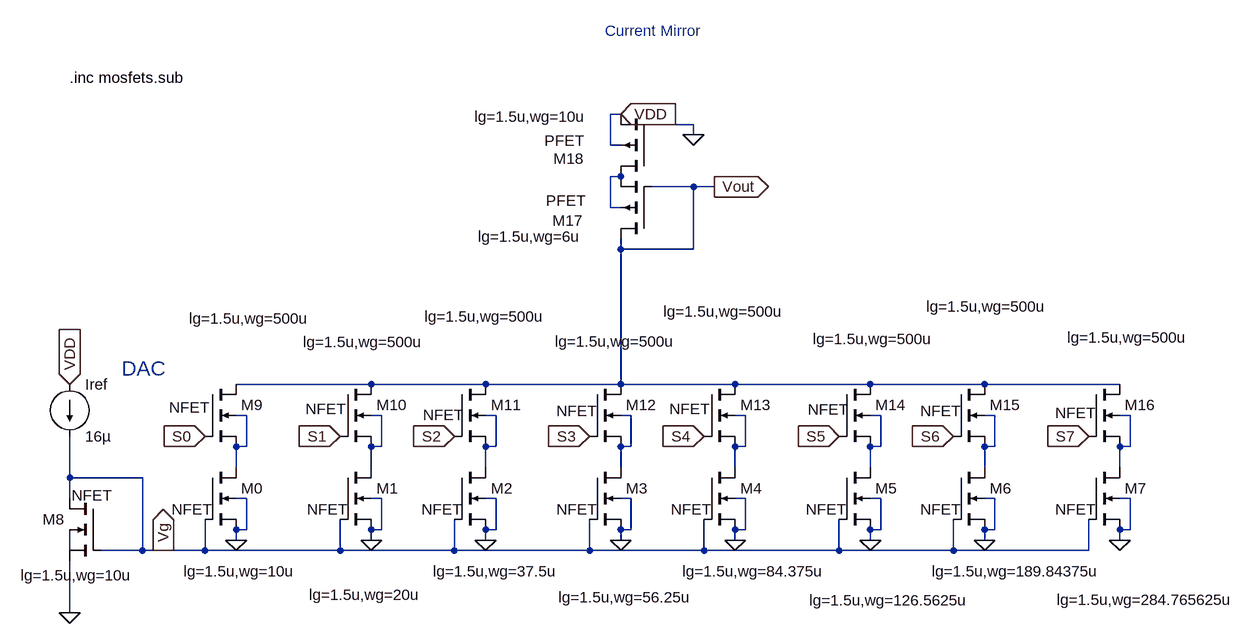
[diagram p0: schematic 3_DAC_winterg.asc]
3_DAC_winterg.asc, the LTspice schematic file:
Version 4
SHEET 1 1748 680
WIRE 784 -240 768 -240
WIRE 896 -224 832 -224
WIRE 896 -208 896 -224
WIRE 768 -192 768 -240
WIRE 784 -192 768 -192
WIRE 784 -144 768 -144
WIRE 896 -128 832 -128
WIRE 928 -128 896 -128
WIRE 768 -96 768 -144
WIRE 784 -96 768 -96
WIRE 784 -32 784 -48
WIRE 896 -32 896 -128
WIRE 896 -32 784 -32
WIRE 400 176 192 176
WIRE 576 176 400 176
WIRE 784 176 784 -32
WIRE 784 176 576 176
WIRE 960 176 784 176
WIRE 1168 176 960 176
WIRE 1344 176 1168 176
WIRE 1552 176 1344 176
WIRE 208 224 192 224
WIRE 416 224 400 224
WIRE 592 224 576 224
WIRE 800 224 784 224
WIRE 976 224 960 224
WIRE 1184 224 1168 224
WIRE 1360 224 1344 224
WIRE 1568 224 1552 224
WIRE 208 272 208 224
WIRE 208 272 192 272
WIRE 416 272 416 224
WIRE 416 272 400 272
WIRE 592 272 592 224
WIRE 592 272 576 272
WIRE 800 272 800 224
WIRE 800 272 784 272
WIRE 976 272 976 224
WIRE 976 272 960 272
WIRE 1184 272 1184 224
WIRE 1184 272 1168 272
WIRE 1360 272 1360 224
WIRE 1360 272 1344 272
WIRE 1568 272 1568 224
WIRE 1568 272 1552 272
WIRE 192 304 192 272
WIRE 400 304 400 272
WIRE 576 304 576 272
WIRE 784 304 784 272
WIRE 960 304 960 272
WIRE 1168 304 1168 272
WIRE 1344 304 1344 272
WIRE 1552 304 1552 272
WIRE -64 320 -64 256
WIRE 48 320 -64 320
WIRE -64 352 -64 320
WIRE 208 352 192 352
WIRE 416 352 400 352
WIRE 592 352 576 352
WIRE 800 352 784 352
WIRE 976 352 960 352
WIRE 1184 352 1168 352
WIRE 1360 352 1344 352
WIRE 1568 352 1552 352
WIRE 208 400 208 352
WIRE 208 400 192 400
WIRE 416 400 416 352
WIRE 416 400 400 400
WIRE 592 400 592 352
WIRE 592 400 576 400
WIRE 800 400 800 352
WIRE 800 400 784 400
WIRE 976 400 976 352
WIRE 976 400 960 400
WIRE 1184 400 1184 352
WIRE 1184 400 1168 400
WIRE 1360 400 1360 352
WIRE 1360 400 1344 400
WIRE 1568 400 1568 352
WIRE 1568 400 1552 400
WIRE 192 416 192 400
WIRE 208 416 192 416
WIRE 400 416 400 400
WIRE 576 416 576 400
WIRE 784 416 784 400
WIRE 960 416 960 400
WIRE 1168 416 1168 400
WIRE 1344 416 1344 400
WIRE 1552 416 1552 400
WIRE -64 432 -64 400
WIRE 48 432 48 320
WIRE 48 432 -16 432
WIRE 80 432 48 432
WIRE 144 432 144 384
WIRE 144 432 80 432
WIRE 352 432 352 384
WIRE 352 432 144 432
WIRE 528 432 528 384
WIRE 528 432 352 432
WIRE 736 432 736 384
WIRE 736 432 528 432
WIRE 912 432 912 384
WIRE 912 432 736 432
WIRE 1120 432 1120 384
WIRE 1120 432 912 432
WIRE 1296 432 1296 384
WIRE 1296 432 1120 432
WIRE 1504 432 1504 384
WIRE 1504 432 1296 432
WIRE -64 528 -64 448
FLAG -64 176 VDD
IOPIN -64 176 In
FLAG -64 528 0
FLAG 192 416 0
FLAG 400 416 0
FLAG 576 416 0
FLAG 784 416 0
FLAG 960 416 0
FLAG 1168 416 0
FLAG 1344 416 0
FLAG 1552 416 0
FLAG 144 256 S0
IOPIN 144 256 In
FLAG 352 256 S1
IOPIN 352 256 In
FLAG 528 256 S2
IOPIN 528 256 In
FLAG 736 256 S3
IOPIN 736 256 In
FLAG 912 256 S4
IOPIN 912 256 In
FLAG 1120 256 S5
IOPIN 1120 256 In
FLAG 1296 256 S6
IOPIN 1296 256 In
FLAG 1504 256 S7
IOPIN 1504 256 In
FLAG 928 -128 Vout
IOPIN 928 -128 Out
FLAG 784 -240 VDD
IOPIN 784 -240 In
FLAG 896 -208 0
FLAG 80 432 Vg
IOPIN 80 432 Out
SYMBOL current -64 176 R0
SYMATTR InstName Iref
SYMATTR Value 16µ
SYMBOL nmos4 -16 352 M0
WINDOW 123 -49 118 Left 2
WINDOW 3 -18 -5 Left 2
SYMATTR Value2 lg=1.5u,wg=10u
SYMATTR Value NFET
SYMATTR InstName M8
SYMATTR Prefix X
SYMBOL nmos4 144 304 R0
WINDOW 123 -33 160 Left 2
WINDOW 3 -51 65 Left 2
SYMATTR Value2 lg=1.5u,wg=10u
SYMATTR Value NFET
SYMATTR InstName M0
SYMATTR Prefix X
SYMBOL nmos4 352 304 R0
WINDOW 123 -48 196 Left 2
WINDOW 3 -51 65 Left 2
SYMATTR Value2 lg=1.5u,wg=20u
SYMATTR Value NFET
SYMATTR InstName M1
SYMATTR Prefix X
SYMBOL nmos4 528 304 R0
WINDOW 123 -33 160 Left 2
WINDOW 3 -51 65 Left 2
SYMATTR Value2 lg=1.5u,wg=37.5u
SYMATTR Value NFET
SYMATTR InstName M2
SYMATTR Prefix X
SYMBOL nmos4 736 304 R0
WINDOW 123 -48 200 Left 2
WINDOW 3 -51 65 Left 2
SYMATTR Value2 lg=1.5u,wg=56.25u
SYMATTR Value NFET
SYMATTR InstName M3
SYMATTR Prefix X
SYMBOL nmos4 912 304 R0
WINDOW 123 -33 160 Left 2
WINDOW 3 -51 65 Left 2
SYMATTR Value2 lg=1.5u,wg=84.375u
SYMATTR Value NFET
SYMATTR InstName M4
SYMATTR Prefix X
SYMBOL nmos4 1120 304 R0
WINDOW 123 -46 205 Left 2
WINDOW 3 -51 65 Left 2
SYMATTR Value2 lg=1.5u,wg=126.5625u
SYMATTR Value NFET
SYMATTR InstName M5
SYMATTR Prefix X
SYMBOL nmos4 1296 304 R0
WINDOW 123 -33 160 Left 2
WINDOW 3 -51 65 Left 2
SYMATTR Value2 lg=1.5u,wg=189.84375u
SYMATTR Value NFET
SYMATTR InstName M6
SYMATTR Prefix X
SYMBOL nmos4 1504 304 R0
WINDOW 123 -49 204 Left 2
WINDOW 3 -51 65 Left 2
SYMATTR Value2 lg=1.5u,wg=284.765625u
SYMATTR Value NFET
SYMATTR InstName M7
SYMATTR Prefix X
SYMBOL nmos4 144 176 R0
WINDOW 123 -24 -101 Left 2
WINDOW 3 -55 36 Left 2
SYMATTR Value2 lg=1.5u,wg=500u
SYMATTR Value NFET
SYMATTR InstName M9
SYMATTR Prefix X
SYMBOL nmos4 352 176 R0
WINDOW 123 -57 -65 Left 2
WINDOW 3 -53 38 Left 2
SYMATTR Value2 lg=1.5u,wg=500u
SYMATTR Value NFET
SYMATTR InstName M10
SYMATTR Prefix X
SYMBOL nmos4 528 176 R0
WINDOW 123 -46 -104 Left 2
WINDOW 3 -48 47 Left 2
SYMATTR Value2 lg=1.5u,wg=500u
SYMATTR Value NFET
SYMATTR InstName M11
SYMATTR Prefix X
SYMBOL nmos4 736 176 R0
WINDOW 123 -53 -66 Left 2
WINDOW 3 -51 41 Left 2
SYMATTR Value2 lg=1.5u,wg=500u
SYMATTR Value NFET
SYMATTR InstName M12
SYMATTR Prefix X
SYMBOL nmos4 912 176 R0
WINDOW 123 -62 -112 Left 2
WINDOW 3 -53 38 Left 2
SYMATTR Value2 lg=1.5u,wg=500u
SYMATTR Value NFET
SYMATTR InstName M13
SYMATTR Prefix X
SYMBOL nmos4 1120 176 R0
WINDOW 123 -40 -70 Left 2
WINDOW 3 -48 39 Left 2
SYMATTR Value2 lg=1.5u,wg=500u
SYMATTR Value NFET
SYMATTR InstName M14
SYMATTR Prefix X
SYMBOL nmos4 1296 176 R0
WINDOW 123 -42 -120 Left 2
WINDOW 3 -51 41 Left 2
SYMATTR Value2 lg=1.5u,wg=500u
SYMATTR Value NFET
SYMATTR InstName M15
SYMATTR Prefix X
SYMBOL nmos4 1504 176 R0
WINDOW 123 -33 -72 Left 2
WINDOW 3 -51 44 Left 2
SYMATTR Value2 lg=1.5u,wg=500u
SYMATTR Value NFET
SYMATTR InstName M16
SYMATTR Prefix X
SYMBOL pmos4 832 -48 R180
WINDOW 123 109 3 Left 2
WINDOW 0 106 28 Left 2
WINDOW 3 102 59 Left 2
SYMATTR Value2 lg=1.5u,wg=6u
SYMATTR InstName M17
SYMATTR Value PFET
SYMATTR Prefix X
SYMBOL pmos4 832 -144 R180
WINDOW 123 101 92 Left 2
WINDOW 0 104 27 Left 2
WINDOW 3 104 55 Left 2
SYMATTR Value2 lg=1.5u,wg=10u
SYMATTR InstName M18
SYMATTR Value PFET
SYMATTR Prefix X
TEXT -64 -296 Left 2 !.inc mosfets.sub
TEXT 760 -368 Left 2 ;Current Mirror
TEXT 16 152 Left 3 ;DAC

The netlist it stands for:
* 3_DAC_winterg.asc
Iref VDD Vg 16µ
XM8 Vg Vg 0 N010 NFET lg=1.5u,wg=10u  ; pins D G S B
XM0 N002 Vg 0 0 NFET lg=1.5u,wg=10u  ; pins D G S B
XM1 N003 Vg 0 0 NFET lg=1.5u,wg=20u  ; pins D G S B
XM2 N004 Vg 0 0 NFET lg=1.5u,wg=37.5u  ; pins D G S B
XM3 N005 Vg 0 0 NFET lg=1.5u,wg=56.25u  ; pins D G S B
XM4 N006 Vg 0 0 NFET lg=1.5u,wg=84.375u  ; pins D G S B
XM5 N007 Vg 0 0 NFET lg=1.5u,wg=126.5625u  ; pins D G S B
XM6 N008 Vg 0 0 NFET lg=1.5u,wg=189.84375u  ; pins D G S B
XM7 N009 Vg 0 0 NFET lg=1.5u,wg=284.765625u  ; pins D G S B
XM9 Vout S0 N002 N002 NFET lg=1.5u,wg=500u  ; pins D G S B
XM10 Vout S1 N003 N003 NFET lg=1.5u,wg=500u  ; pins D G S B
XM11 Vout S2 N004 N004 NFET lg=1.5u,wg=500u  ; pins D G S B
XM12 Vout S3 N005 N005 NFET lg=1.5u,wg=500u  ; pins D G S B
XM13 Vout S4 N006 N006 NFET lg=1.5u,wg=500u  ; pins D G S B
XM14 Vout S5 N007 N007 NFET lg=1.5u,wg=500u  ; pins D G S B
XM15 Vout S6 N008 N008 NFET lg=1.5u,wg=500u  ; pins D G S B
XM16 Vout S7 N009 N009 NFET lg=1.5u,wg=500u  ; pins D G S B
XM17 Vout Vout N001 N001 PFET lg=1.5u,wg=6u  ; pins D G S B
XM18 N001 0 VDD VDD PFET lg=1.5u,wg=10u  ; pins D G S B
.inc mosfets.sub
* Current Mirror
* DAC
.backanno
.end